# EAGLE schematic PCB-AC2b (EAGLE 6.4)

## Sheet 1 of 2
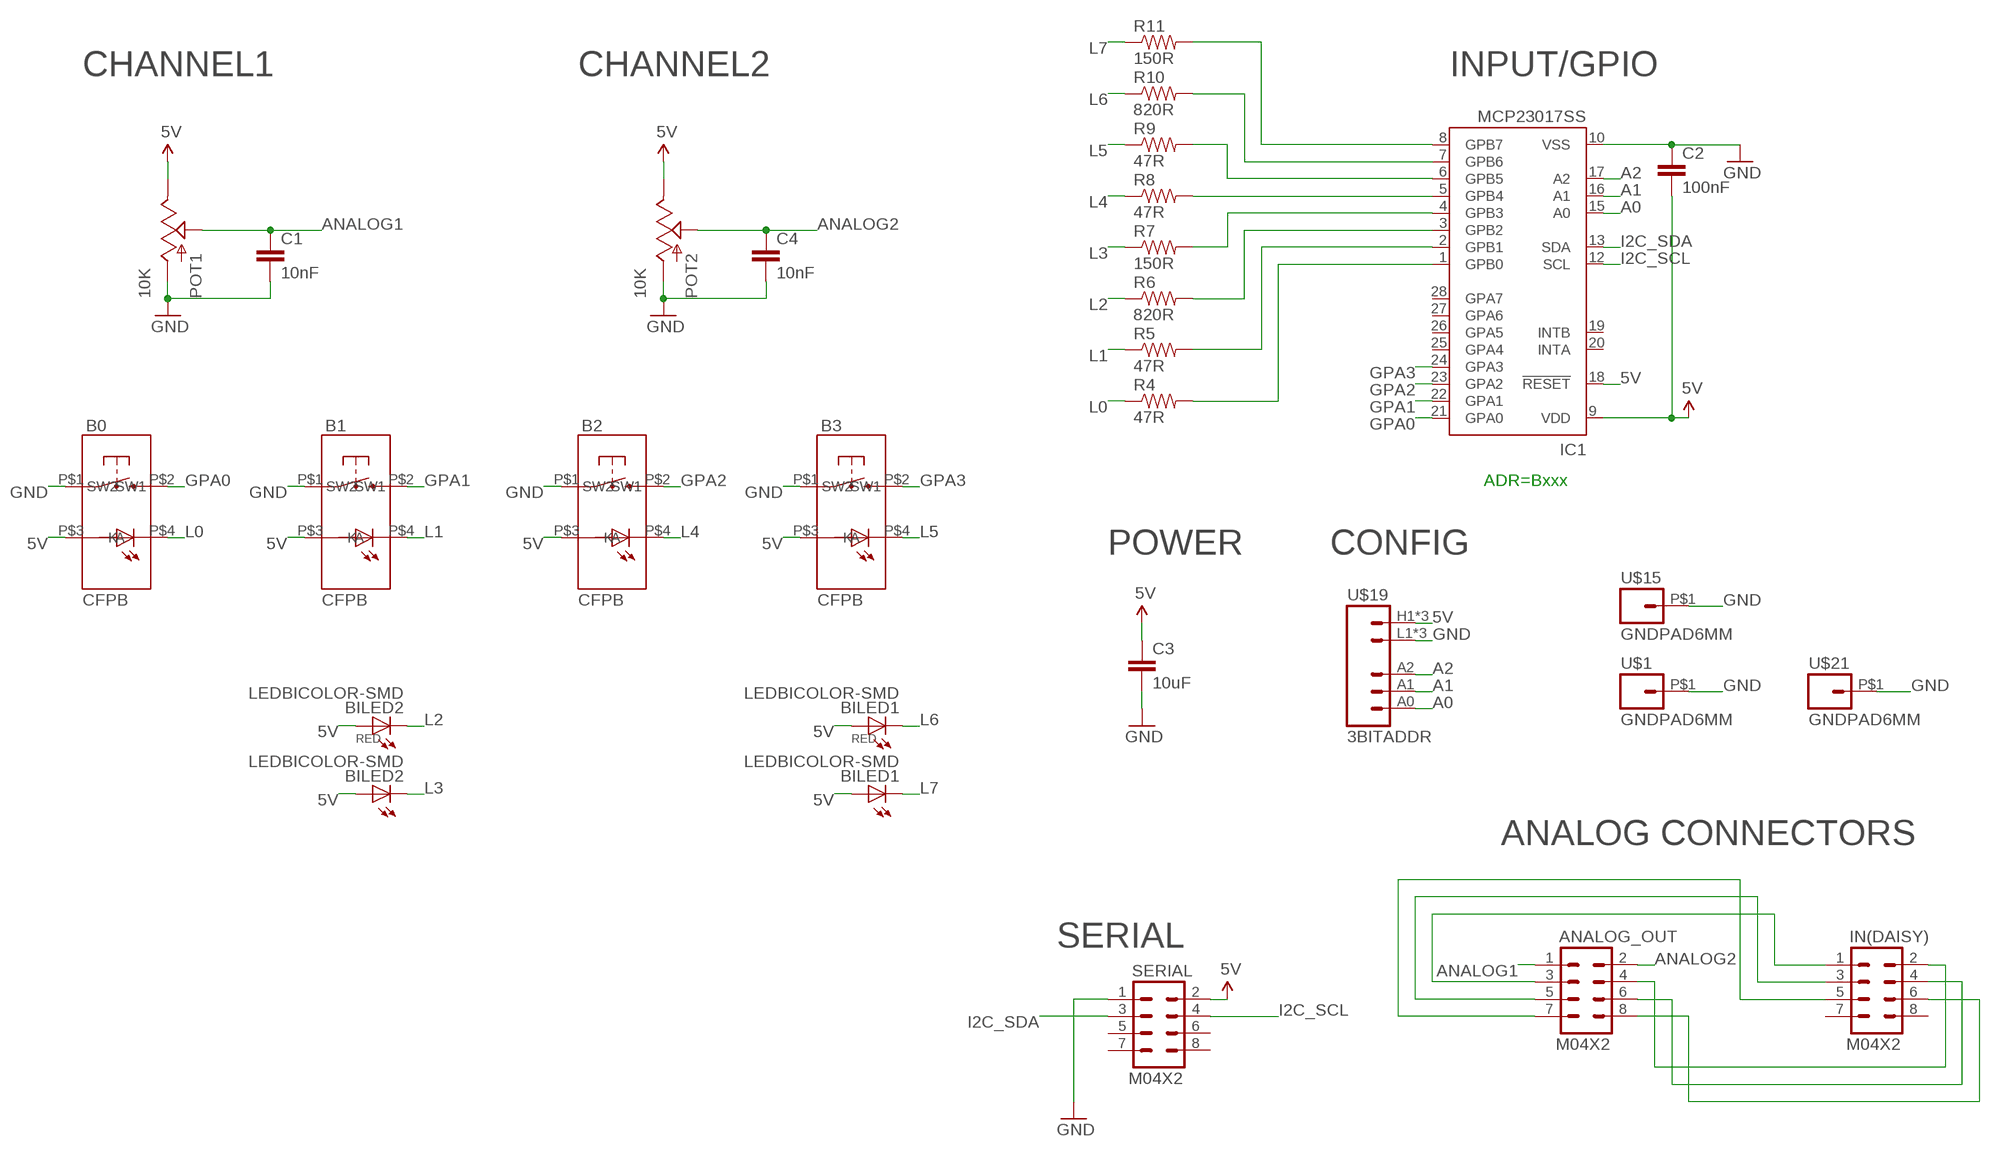
[diagram p0: schematic, sheet 1]

### Parts
ANALOG_OUT  M04X2  [2X4]
B0  CFPB  [CFPB-6/9MM]
B1  CFPB  [CFPB-6/9MM]
B2  CFPB  [CFPB-6/9MM]
B3  CFPB  [CFPB-6/9MM]
BILED1  LEDBICOLOR-SMD  [LEDBICOLOR-SMD]
BILED2  LEDBICOLOR-SMD  [LEDBICOLOR-SMD]
C1  10nF  CAP0603-CAP  [0603-CAP]
C2  100nF  CAP0603-CAP  [0603-CAP]
C3  10uF  CAP0805  [0805]
C4  10nF  CAP0603-CAP  [0603-CAP]
IC1  MCP23017SS  [SSOP28]
IN(DAISY)  M04X2  [2X4]
POT1  10K  POT  [ALPS_POT]
POT2  10K  POT  [ALPS_POT]
R4  47R  RESISTOR0603-RES  [0603-RES]
R5  47R  RESISTOR0603-RES  [0603-RES]
R6  820R  RESISTOR0603-RES  [0603-RES]
R7  150R  RESISTOR0603-RES  [0603-RES]
R8  47R  RESISTOR0603-RES  [0603-RES]
R9  47R  RESISTOR0603-RES  [0603-RES]
R10  820R  RESISTOR0603-RES  [0603-RES]
R11  150R  RESISTOR0603-RES  [0603-RES]
SERIAL  M04X2  [2X4]
U$1  GNDPAD6MM  [3.2MMPAD6MM]
U$15  GNDPAD6MM  [3.2MMPAD6MM]
U$19  3BITADDR  [3BITADDR]
U$21  GNDPAD6MM  [3.2MMPAD6MM]

### Nets
5V [Power]: B0.P$3(A) B1.P$3(A) B2.P$3(A) B3.P$3(A) BILED1.P$1(A) BILED1.P$3(A1) BILED2.P$1(A) BILED2.P$3(A1) C2.2 C3.1 IC1.9(VDD) IC1.18(!RESET) POT1.P$1(E) POT2.P$1(E) SERIAL.2 U$19.H1(VCC) U$19.H2(VCC) U$19.H3(VCC)
A0: IC1.15(A0) U$19.A0
A1: IC1.16(A1) U$19.A1
A2: IC1.17(A2) U$19.A2
ANALOG1: ANALOG_OUT.1 C1.1 POT1.P$2(S)
ANALOG2: ANALOG_OUT.2 C4.1 POT2.P$2(S)
GND [Power]: B0.P$1(SW1) B1.P$1(SW1) B2.P$1(SW1) B3.P$1(SW1) C1.2 C2.1 C3.2 C4.2 IC1.10(VSS) POT1.P$3(A) POT2.P$3(A) SERIAL.1 U$1.P$1 U$15.P$1 U$19.L1(GND) U$19.L2(GND) U$19.L3(GND) U$21.P$1
GPA0: B0.P$2(SW2) IC1.21(GPA0)
GPA1: B1.P$2(SW2) IC1.22(GPA1)
GPA2: B2.P$2(SW2) IC1.23(GPA2)
GPA3: B3.P$2(SW2) IC1.24(GPA3)
I2C_SCL: IC1.12(SCL) SERIAL.4
I2C_SDA: IC1.13(SDA) SERIAL.3
L0: B0.P$4(K) R4.1
L1: B1.P$4(K) R5.1
L2: BILED2.P$2(C) R6.1
L3: BILED2.P$4(C1) R7.1
L4: B2.P$4(K) R8.1
L5: B3.P$4(K) R9.1
L6: BILED1.P$2(C) R10.1
L7: BILED1.P$4(C1) R11.1
N$2: IC1.4(GPB3) R7.2
N$3: IC1.5(GPB4) R8.2
N$4: IC1.6(GPB5) R9.2
N$5: IC1.7(GPB6) R10.2
N$6: IC1.8(GPB7) R11.2
N$7: IC1.3(GPB2) R6.2
N$8: IC1.2(GPB1) R5.2
N$9: IC1.1(GPB0) R4.2
N$10: ANALOG_OUT.3 IN(DAISY).1
N$11: ANALOG_OUT.5 IN(DAISY).3
N$12: ANALOG_OUT.7 IN(DAISY).5
N$13: ANALOG_OUT.4 IN(DAISY).2
N$14: ANALOG_OUT.6 IN(DAISY).4
N$15: ANALOG_OUT.8 IN(DAISY).6
Unconnected: IC1.19(INTB) IC1.20(INTA) IC1.25(GPA4) IC1.26(GPA5) IC1.27(GPA6) IC1.28(GPA7) IN(DAISY).7 IN(DAISY).8 SERIAL.5 SERIAL.6 SERIAL.7 SERIAL.8

### Notes on the sheet
- CHANNEL1 | CHANNEL2 | INPUT/GPIO
- ADR=Bxxx
- POWER | CONFIG
- ANALOG CONNECTORS
- SERIAL

## Sheet 2 of 2

## Library data of the parts
ANALOG_OUT IN(DAISY) SERIAL = SparkFun:M04X2
B0 B1-B3 = SKAARHOJ:CFPB
BILED1 BILED2 = SKAARHOJ:LEDBICOLOR-SMD
C1-C4 = SparkFun:CAP: Capacitor Standard 0603 ceramic capacitor, and 0.1" leaded capacitor.
IC1 = microchip:MCP23017: http://ww1.microchip.com/downloads/en/DeviceDoc/21952a.pdf Source: http://ww1.microchip.com/downloads/en/DeviceDoc/21952a.pdf; MF: MICROCHIP; MPN: MCP23017-E/SS; OC_FARNELL: 1467674; OC_NEWARK: 31K2960
POT1 POT2 = SparkFun:POT
R4-R11 = SparkFun:RESISTOR: Resistor Basic schematic elements and footprints for 0603, 1206, and PTH resistors.
U$1 U$15 U$21 = SKAARHOJ:GNDPAD
U$19 = SKAARHOJ:3BITADDR

## Net classes
0 default: width 0.203 mm, drill 0.406 mm, clearance 0.203 mm
1 Power: width 0.406 mm, drill 0.61 mm, clearance 0.203 mm